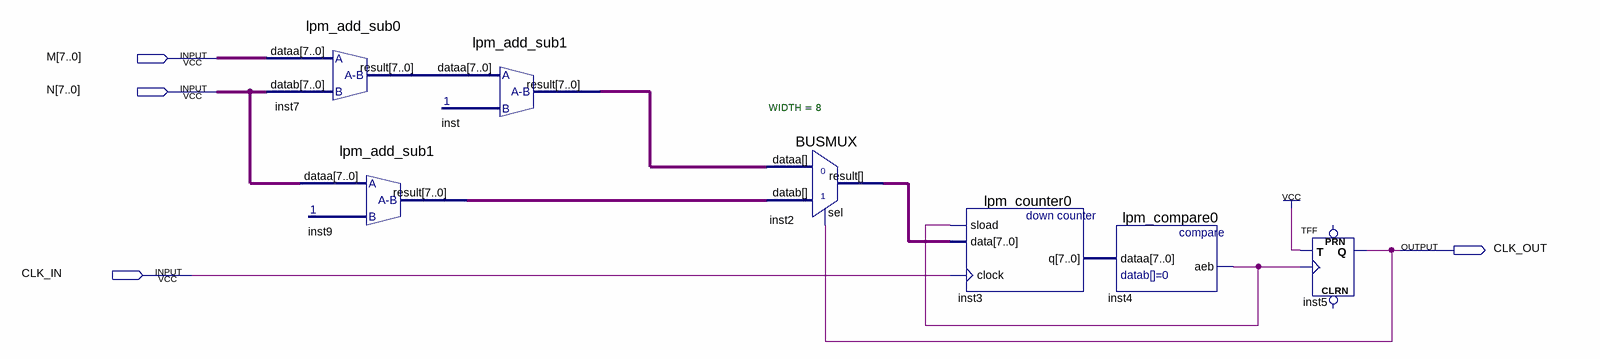
[diagram p0: schematic sheet]
// Quartus schematic MNGenerator.bdf as structural Verilog: 7 symbols, 4 pins
module MNGenerator (
  input  [7:0] M,
  input  [7:0] N,
  input  CLK_IN,
  output CLK_OUT
);

  wire inst4_aeb;
  wire [7:0] inst2_result, inst3_q, inst7_result, inst9_result, inst_result;

  lpm_add_sub0 inst7 (.dataa(M), .datab(N), .result(inst7_result));
  lpm_add_sub1 inst9 (.dataa(N), .result(inst9_result));
  lpm_add_sub1 inst (.dataa(inst7_result), .result(inst_result));
  BUSMUX #(.WIDTH(8)) inst2 (.datab(inst9_result), .sel(CLK_OUT), .dataa(inst_result), .result(inst2_result));
  lpm_counter0 inst3 (.sload(inst4_aeb), .data(inst2_result), .clock(CLK_IN), .q(inst3_q));
  lpm_compare0 inst4 (.dataa(inst3_q), .aeb(inst4_aeb));
  TFF inst5 (.T(1'b1), .CLK(inst4_aeb), .Q(CLK_OUT));  // open: PRN, CLRN
endmodule
